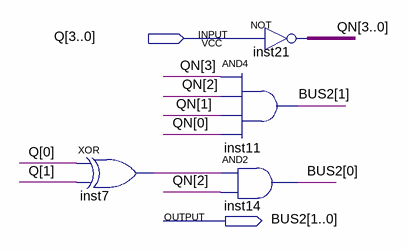
[diagram p0: schematic sheet]
// Quartus schematic BUS2.bdf as structural Verilog: 4 symbols, 2 pins
module BUS2 (
  input  [3:0] Q,
  output [1:0] BUS2
);

  wire inst7_out;
  wire [3:0] QN;

  xor inst7 (inst7_out, Q[0], Q[1]);
  assign QN = ~Q;  // NOT inst21, 4 bits wide
  and inst11 (BUS2[1], QN[3], QN[2], QN[1], QN[0]);
  and inst14 (BUS2[0], inst7_out, QN[2]);
endmodule
